# Altium schematic sheet ERN_Main_3.SchDoc
size A; SheetNumber: 3; SheetTotal: 4; SPICEModelCacheXVWYUVSQ: <root> / <DocumentId>XVWYUVSQ</DocumentId> / <CacheFrame Number="0"> / <Model Name="irf1010" Kind="CKT"> / <Text>*IRF1010 MCE 4-2-96 / *55V  75A .014 ohm HEXFET pkg:TO-220 2,1,3 / .SUBCKT IRF1010  10 20 40 40 / M1   1  2  3  3  DMOS L=1U W=1U / RD  10  1  5.65M / RS  30  3  1.35M / RG  20  2  12.1 / CGS  2  3  2.15N / EGD 12  0  2  1  1 / VFB 14  0  0 / FFB  2  1  VFB  1 / CGD 13 14  4.49N / R1  13  0  1 / D1  12 13  DLIM / DDG 15 14  DCGD / R2  12 15  1 / D2  15  0  DLIM / DSD  3 10  DSUB / LS  30 40  7.5N / .MODEL DMOS NMOS (LEVEL=3 THETA=60M VMAX=114K ETA=2M VTO=3 KP=19.4) / .MODEL DCGD D (CJO=4.49N VJ=.6 M=.68) / .MODEL DSUB D (IS=311N N=1.5 RS=8.67M BV=55 CJO=4.08N VJ=.8 M=.42 TT=100N) / .MODEL DLIM D (IS=100U) / .ENDS IRF1010</Text> / </Model> / <Model Name="1n4148" Kind="MDL"> / <Text>.model 1N4148  D(Is=0.1p Rs=16 CJO=2p Tt=12n Bv=100 Ibv=0.1p)</Text> / </Model> / <Model Name="npn" Kind="MDL"> / <Text>*Default NPN BJT / *NPN Trans Pinout: C,B,E / .MODEL NPN NPN()</Text> / </Model> / </CacheFrame> / </root>
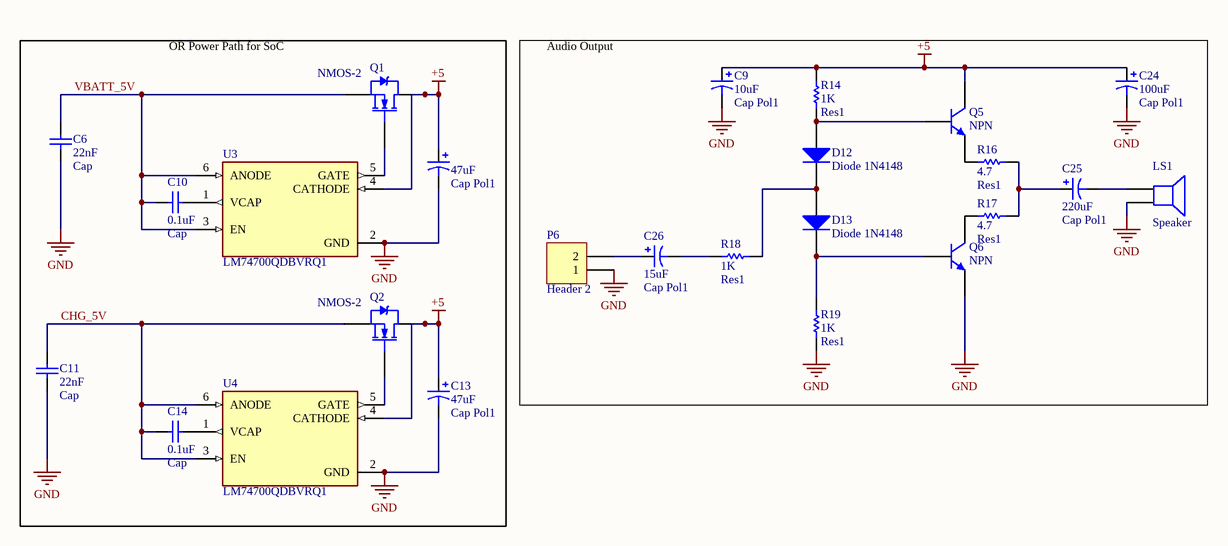
[diagram p0: ERN_Main_3.SchDoc]

## Parts
?  Cap Pol1  value 47uF  [RB7.6-15]
C6  Cap  value 22nF  [RAD-0.3]
C9  Cap Pol1  value 10uF  [RB7.6-15]
C10  Cap  value 0.1uF  [RAD-0.3]
C11  Cap  value 22nF  [RAD-0.3]
C13  Cap Pol1  value 47uF  [RB7.6-15]
C14  Cap  value 0.1uF  [RAD-0.3]
C24  Cap Pol1  value 100uF  [RB7.6-15]
C25  Cap Pol1  value 220uF  [RB7.6-15]
C26  Cap Pol1  value 15uF  [RB7.6-15]
D12  Diode 1N4148  [DO-35]
D13  Diode 1N4148  [DO-35]
LS1  Speaker  [PIN2]
P6  Header 2  [HDR1X2]
Q1  NMOS-2  [TO-220AB]
Q2  NMOS-2  [TO-220AB]
Q5  NPN  [TO-226-AA]
Q6  NPN  [TO-226-AA]
R14  Res1  value 1K  [AXIAL-0.3]
R16  Res1  value 4.7  [AXIAL-0.3]
R17  Res1  value 4.7  [AXIAL-0.3]
R18  Res1  value 1K  [AXIAL-0.3]
R19  Res1  value 1K  [AXIAL-0.3]
U3  LM74700QDBVRQ1  [SOT95P280X145-6N]
U4  LM74700QDBVRQ1  [SOT95P280X145-6N]

## Blocks framed on the sheet
OR Power Path for SoC: ? C6 C10 C11 C13 C14 Q1 Q2 U3 U4
Audio Output: C9 C24-C26 D12 D13 LS1 P6 Q5 Q6 R14 R16-R19

## Nets
+5: ?.1 C9.1 C13.1 C24.1 Q1.2(D) Q2.2(D) Q5.1(C) R14.2 U3.4(CATHODE) U4.4(CATHODE)
GND: ?.2 C6.1 C9.2 C11.1 C13.2 C24.2 LS1.2 P6.1 Q6.3(E) R19.1 U3.2(GND) U4.2(GND)
CHG_5V: C11.2 C14.2 Q2.3(S) U4.3(EN) U4.6(ANODE)
VBATT_5V: C6.2 C10.2 Q1.3(S) U3.3(EN) U3.6(ANODE)
NetC10_1: C10.1 U3.1(VCAP)
NetC14_1: C14.1 U4.1(VCAP)
NetC25_1: C25.1 R16.2 R17.2
NetC25_2: C25.2 LS1.1
NetC26_1: C26.1 P6.2
NetC26_2: C26.2 R18.1
NetD12_1: D12.1(A) Q5.2(B) R14.1
NetD12_2: D12.2(K) D13.1(A) R18.2
NetD13_2: D13.2(K) Q6.2(B) R19.2
NetQ1_1: Q1.1(G) U3.5(GATE)
NetQ2_1: Q2.1(G) U4.5(GATE)
NetQ5_3: Q5.3(E) R16.1
NetQ6_1: Q6.1(C) R17.1

## Library data of the parts
? C9 C13 C24-C26 = Cap Pol1: Polarized Capacitor (Radial); Published: 8-Jun-2000; LatestRevisionDate: 17-Jul-2002; LatestRevisionNote: Re-released for DXP Platform.; PackageReference: RB7.6-15; Publisher: Altium Limited; PackageDescription: Polarized Capacitor (Radial); 2 Leads
C6 C10 C11 C14 = Cap: Capacitor; Published: 8-Jun-2000; LatestRevisionDate: 17-Jul-2002; LatestRevisionNote: Re-released for DXP Platform.; PackageReference: RAD-0.3; Publisher: Altium Limited; PackageDescription: Radial Cap, Thru-Hole; 2 Leads; 0.3 in Pin Spacing
D12 D13 = Diode 1N4148: High Conductance Fast Diode; Published: 8-Jun-2000; LatestRevisionDate: 17-Jul-2002; LatestRevisionNote: Re-released for DXP Platform.; DatasheetVersion: 1997; PackageReference: DO-35; Publisher: Altium Limited; PackageDescription: Diode, Axial; Body 3.8 x 1.9 mm (LxDia. max), Lead Dia. 0.53 mm (max); Code_JEDEC: DO-204-AH; ComponentLink1Description: Manufacturer Link; ComponentLink1URL: http://www.fairchildsemi.com/; ComponentLink2Description: Datasheet; ComponentLink2URL: http://www.fairchildsemi.com/ds/1N%2F1N4148.pdf
LS1 = Speaker: Loudspeaker; Published: 24-Mar-1999; LatestRevisionDate: 17-Jul-2002; LatestRevisionNote: Re-released for DXP Platform.; PackageReference: PIN2; Publisher: Altium Limited
P6 = Header 2: Header, 2-Pin; LatestRevisionDate: 17-Jul-2002; LatestRevisionNote: Re-released for DXP Platform.; Publisher: Altium Limited
Q1 Q2 = NMOS-2: N-Channel Power MOSFET; Note: Pin 2 is electrically connected to pin 4.; Published: 8-Jun-2000; LatestRevisionDate: 17-Jul-2002; LatestRevisionNote: Re-released for DXP Platform.; DatasheetVersion: PD-9.814; PackageVersion: Feb-1997; PackageReference: TO-220AB; Publisher: Altium Limited; PackageDescription: TO, Thru-Hole, Vertical, Heatsink Mounted; 3 In-Line Leads; Pitch 2.54 mm; ComponentLink1Description: Manufacturer Link; ComponentLink1URL: http://www.irf.com/
Q5 Q6 = NPN: NPN Bipolar Transistor; Published: 8-Jun-2000; LatestRevisionDate: 17-Jul-2002; LatestRevisionNote: Re-released for DXP Platform.; PackageReference: TO-226-AA; Publisher: Altium Limited; PackageDescription: TO, Flat Index; 3 In-Line, Axial Leads; Body Dia. 4.8mm; Leads 0.55 x 0.51 mm (max); Code_JEDEC: TO-226-AA
R14 R16-R19 = Res1: Resistor; Published: 8-Jun-2000; LatestRevisionDate: 17-Jul-2002; LatestRevisionNote: Re-released for DXP Platform.; PackageReference: AXIAL-0.3; Publisher: Altium Limited; PackageDescription: Axial Device, Thru-Hole; 2 Leads; 0.3 in Pin Spacing
U3 U4 = LM74700QDBVRQ1: 3.2-V to 65-V, 80-uA IQ automotive ideal diode controller; MF: Texas Instruments; SnapEDA_Link: https://www.snapeda.com/parts/LM74700QDBVRQ1/Texas+Instruments/view-part/?ref=snap; Package: SOT-23-6 Texas Instruments; Value: *; MP: LM74700QDBVRQ1; Check_prices: https://www.snapeda.com/parts/LM74700QDBVRQ1/Texas+Instruments/view-part/?ref=eda